# Altium project hub_sensor.PrjPcb
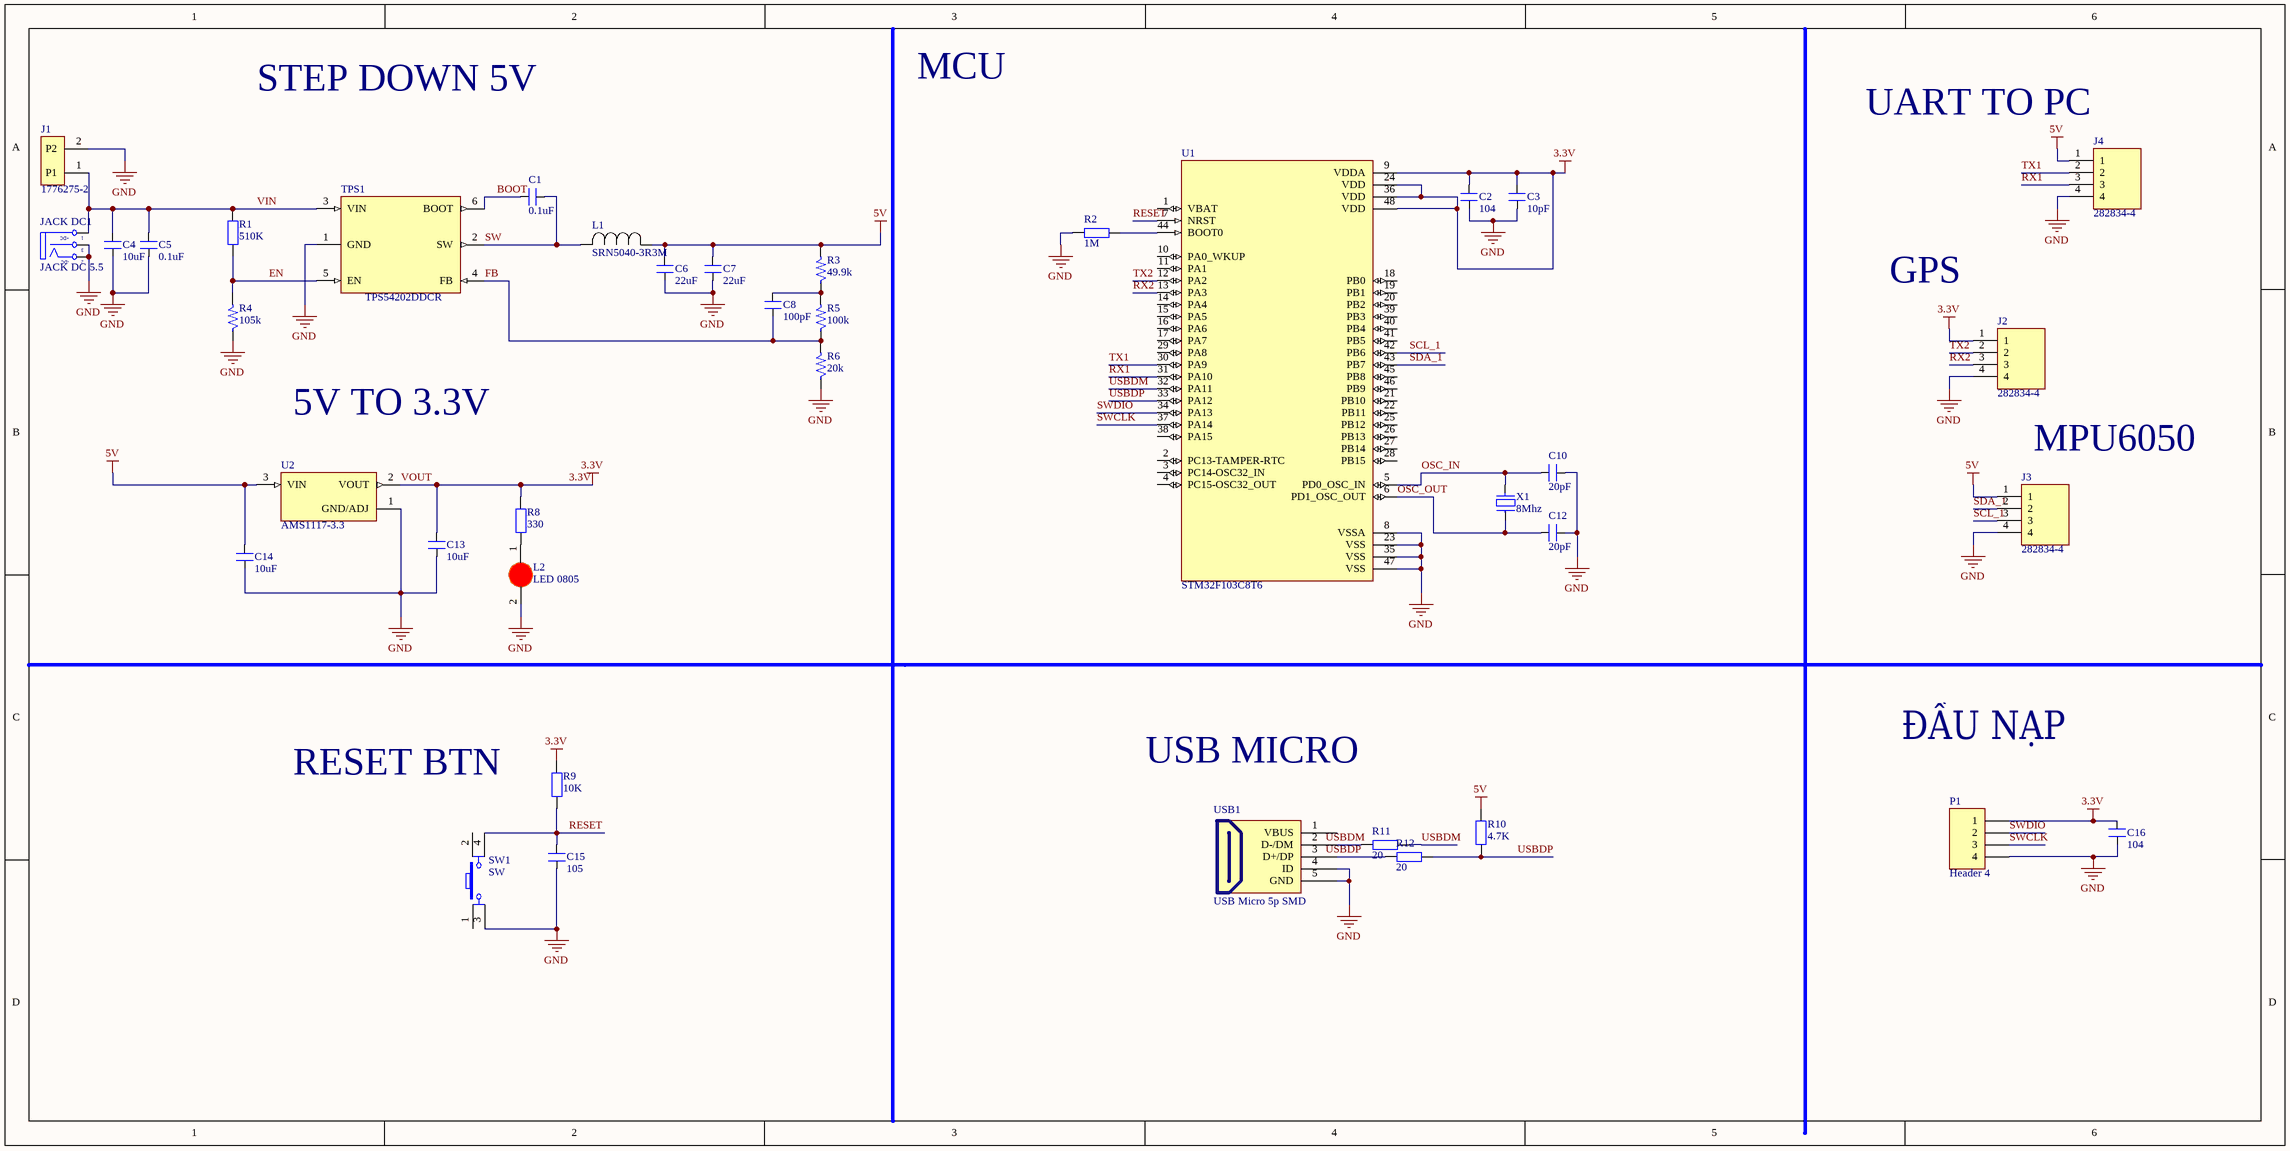
[diagram p0: Sheet2.SchDoc]
1 sheet, 39 parts. Net scope: global (net labels, ports and power ports of the same name join across sheets).
Board file: PCB2.PcbDoc

## Sheet Sheet2.SchDoc
size 482 x 241 mm; SheetNumber: 1; SheetTotal: 1

### Parts
C1  0.1uF  [SM-0805]
C2  104  [SM-0805]
C3  10pF  [SM-0805]
C4  10uF  [SM-0805]
C5  0.1uF  [SM-0805]
C6  22uF  [SM-0805]
C7  22uF  [SM-0805]
C8  100pF  [SM-0805]
C10  20pF  [SM-0805]
C12  20pF  [SM-0805]
C13  10uF  [SM-0805]
C14  10uF  [SM-0805]
C15  105  [SM-0805]
C16  104  [SM-0805]
J1  1776275-2  [TE_1776275-2]
J2  282834-4  [TE_282834-4]
J3  282834-4  [TE_282834-4]
J4  282834-4  [TE_282834-4]
JACK_DC1  JACK DC 5.5  [JACK DC 5.5]
L1  SRN5040-3R3M  [IND_SRN5040_BRN]
L2  LED 0805  [LED-0805-Red]
P1  Header 4  [HDR1X4]
R1  510K  [SM-0805]
R2  1M  [0805 res]
R3  49.9k  [0805 res]
R4  105k  [0805 res]
R5  100k  [0805 res]
R6  20k  [0805 res]
R8  330  [0805 res]
R9  10K  [0805 res]
R10  4.7K  [0805 res]
R11  20  [0805 res]
R12  20  [0805 res]
SW1  SW  [SW4]
TPS1  TPS54202DDCR  [SOT95P280X110-6N]
U1  STM32F103C8T6  [QFP50P900X900X160-48N]
U2  AMS1117-3.3  [SOT229P700X180-4N]
USB1  USB Micro 5p SMD  [USB Micro 5p SMD]
X1  8Mhz  [XT2]

### Nets
3.3V: C2.2 C3.2 C13.2 C16.1 J2.1 P1.1 R8.2 R9.2 U1.9(VDDA) U1.24(VDD) U1.36(VDD) U1.48(VDD) U2.2(VOUT)  [also labelled VOUT]
5V: C6.2 C7.2 C14.2 J3.1 J4.1 L1.1 R3.2 R10.2 U2.3(VIN)
GND: C2.1 C3.1 C4.1 C5.1 C6.1 C7.1 C10.1 C12.1 C13.1 C14.1 C15.1 C16.2 J1.2(P2) J2.4 J3.4 J4.4 JACK_DC1.2(TN) JACK_DC1.3(S) L2.2(K) P1.4 R2.1 R4.1 R6.1 SW1.3 TPS1.1(GND) U1.8(VSSA) U1.23(VSS) U1.35(VSS) U1.47(VSS) U2.1(GND/ADJ) USB1.4(ID) USB1.5(GND)
BOOT: C1.2 TPS1.6(BOOT)
EN: R1.2 R4.2 TPS1.5(EN)
FB: C8.1 R5.1 R6.2 TPS1.4(FB)
OSC_IN: C10.2 U1.5(PD0_OSC_IN) X1.2
OSC_OUT: C12.2 U1.6(PD1_OSC_OUT) X1.1
RESET: C15.2 R9.1 SW1.4 U1.7(NRST)
RX1: J4.3 U1.31(PA10)
RX2: J2.3 U1.13(PA3)
SCL_1: J3.3 U1.42(PB6)
SDA_1: J3.2 U1.43(PB7)
SW: C1.1 L1.2 TPS1.2(SW)
SWCLK: P1.3 U1.37(PA14)
SWDIO: P1.2 U1.34(PA13)
TX1: J4.2 U1.30(PA9)
TX2: J2.2 U1.12(PA2)
USBDM: R11.2 U1.32(PA11)
USBDP: R10.1 R12.2 U1.33(PA12)
VIN: C4.2 C5.2 J1.1(P1) JACK_DC1.1(T) R1.1 TPS1.3(VIN)
NetC8_2: C8.2 R3.1 R5.2
NetL2_1: L2.1(A) R8.1
NetR2_2: R2.2 U1.44(BOOT0)
NetR11_1: R11.1 USB1.2(D-/DM)
NetR12_1: R12.1 USB1.3(D+/DP)

Not connected (* = marked no-connect by the designer): SW1 1 2; U1 1(VBAT) 2(PC13-TAMPER-RTC) 3(PC14-OSC32_IN) 4(PC15-OSC32_OUT) 10(PA0_WKUP) 11(PA1) 14(PA4) 15(PA5) 16(PA6) 17(PA7) 18(PB0) 19(PB1) 20(PB2) 21(PB10) 22(PB11) 25(PB12) 26(PB13) 27(PB14) 28(PB15) 29(PA8) 38(PA15) 39(PB3) 40(PB4) 41(PB5) 45(PB8) 46(PB9); USB1 1(VBUS)

### Notes on the sheet
- MCU
- STEP DOWN 5V
- UART TO PC
- GPS
- 5V TO 3.3V
- MPU6050
- ĐẦU NẠP
- RESET BTN
- USB MICRO
- Labels drawn without touching a wire or pin: USBDM, USBDP
- (in symbol JACK DC 5.5) +DC; -DC

### Library data of the parts
C1-C8 C10 C12-C16 = CM: Cap SMD; Value: 103
J1 = 1776275-2: 2 Position Wire to Board Terminal Block Horizontal with Board 0.138" (3.50mm) Through Hole; MF: TE Connectivity; Package: None; Price: None; Value: *; SnapEDA_Link: https://www.snapeda.com/parts/1776275-2/TE+Connectivity+AMP+Connectors/view-part/?ref=snap; MP: 1776275-2; Availability: Unavailable; Check_prices: https://www.snapeda.com/parts/1776275-2/TE+Connectivity+AMP+Connectors/view-part/?ref=eda
J2-J4 = 282834-4: 4 Position Wire to Board Terminal Block Horizontal with Board 0.100 (2.54mm) Through Hole; MF: TE Connectivity; Check_prices: https://www.snapeda.com/parts/282834-4/TE+Connectivity+AMP+Connectors/view-part/?ref=eda; Price: None; MP: 282834-4; Package: None; Value: *; Purchase-URL: https://pricing.snapeda.com/search/part/282834-4/?ref=eda; Availability: In Stock; EU_RoHS_Compliance: Compliant with Exemptions; SnapEDA_Link: https://www.snapeda.com/parts/282834-4/TE+Connectivity+AMP+Connectors/view-part/?ref=snap
JACK_DC1 = JACK DC 5.5: Value: Jac DC
L1 = SRN5040-3R3M: No Description Available; Mfr_Name: Bourns Electronics; Digi-Key_Part_Number_3: SRN5040-3R3MDKR-ND; Digi-Key_Part_Number_2: SRN5040-3R3MCT-ND; Digi-Key_Part_Number_1: SRN5040-3R3MTR-ND
L2 = LED 0805 Do: Dán; Don_Vi: Con; Ma_Hang: MH000897; Ten_Linh_Kien: LED 0805 Màu Đỏ (Red); Ghi_Chu: *; Kieu_Chan: *; Chung_Loai: Dán
P1 = Header 4: Header, 4-Pin; LatestRevisionDate: 17-Jul-2002; LatestRevisionNote: Re-released for DXP Platform.; Publisher: Altium Limited
R1 R2 R8-R12 = RM: Resistor SMD; Value: 1K
R3-R6 = res0805: Resistor 1/4W; Value: R1/4W - 1K
SW1 = SW4: Switch button 4 pin; Value: Button chip 4 pin
TPS1 = TPS54202DDCR: 4.5V to 28V Input, 2A Output, EMI Friendly Synchronous Step-Down Converter 6-SOT-23-THIN -40 to 125; MF: Texas Instruments; Price: None; Value: *; Texas_Instruments-Purchase-URL: https://snapeda.com/shop?store=Texas+Instruments&id=565860; Mouser-Purchase-URL: https://snapeda.com/shop?store=Mouser&id=565860; Package: SOT-23-THN-6 Texas Instruments; SnapEDA_Link: https://www.snapeda.com/parts/TPS54202DDCR/Texas%20Instruments/view-part/565860/?ref=snap; Availability: Good; MP: TPS54202DDCR; DigiKey-Purchase-URL: https://snapeda.com/shop?store=DigiKey&id=565860; BuyPart: https://www.snapeda.com/parts/TPS54202DDCR/Texas%20Instruments/view-part/565860/?ref=eda
U1 = STM32F103C8T6: ARM® Cortex®-M3 STM32F1 Microcontroller IC 32-Bit 72MHz 64KB (64K x 8) FLASH 48-LQFP (7x7); MF: STMicroelectronics; SnapEDA_Link: https://www.snapeda.com/parts/STM32F103C8T6/STMicroelectronics/view-part/?ref=snap; Package: LQFP-48 STMicroelectronics; Value: *; MP: STM32F103C8T6; Check_prices: https://www.snapeda.com/parts/STM32F103C8T6/STMicroelectronics/view-part/?ref=eda
U2 = AMS1117-3.3: Sot223/Pkg 1-Amp 3.3-Volt Low Drop Out Voltage Regulatator; MF: Advanced Monolithic Systems; Package: SOT-223 Seeed Technology; Value: *; Check_prices: https://www.snapeda.com/parts/AMS1117-3.3/Advanced+Monolithic+Systems/view-part/?ref=eda; Price: None; Availability: Not in stock; MP: AMS1117-3.3; SnapEDA_Link: https://www.snapeda.com/parts/AMS1117-3.3/Advanced+Monolithic+Systems/view-part/?ref=snap
USB1 = USB Micro 5p SMD: USB Type B; Ten: MicroUSB MK5P SMD; Ma_Hang: MH001020
X1 = XT2: Crystal For all Crystal 2pin.; Value: 4Mhz